# EAGLE design RPi-Display_v10 (EAGLE 7.5.0)
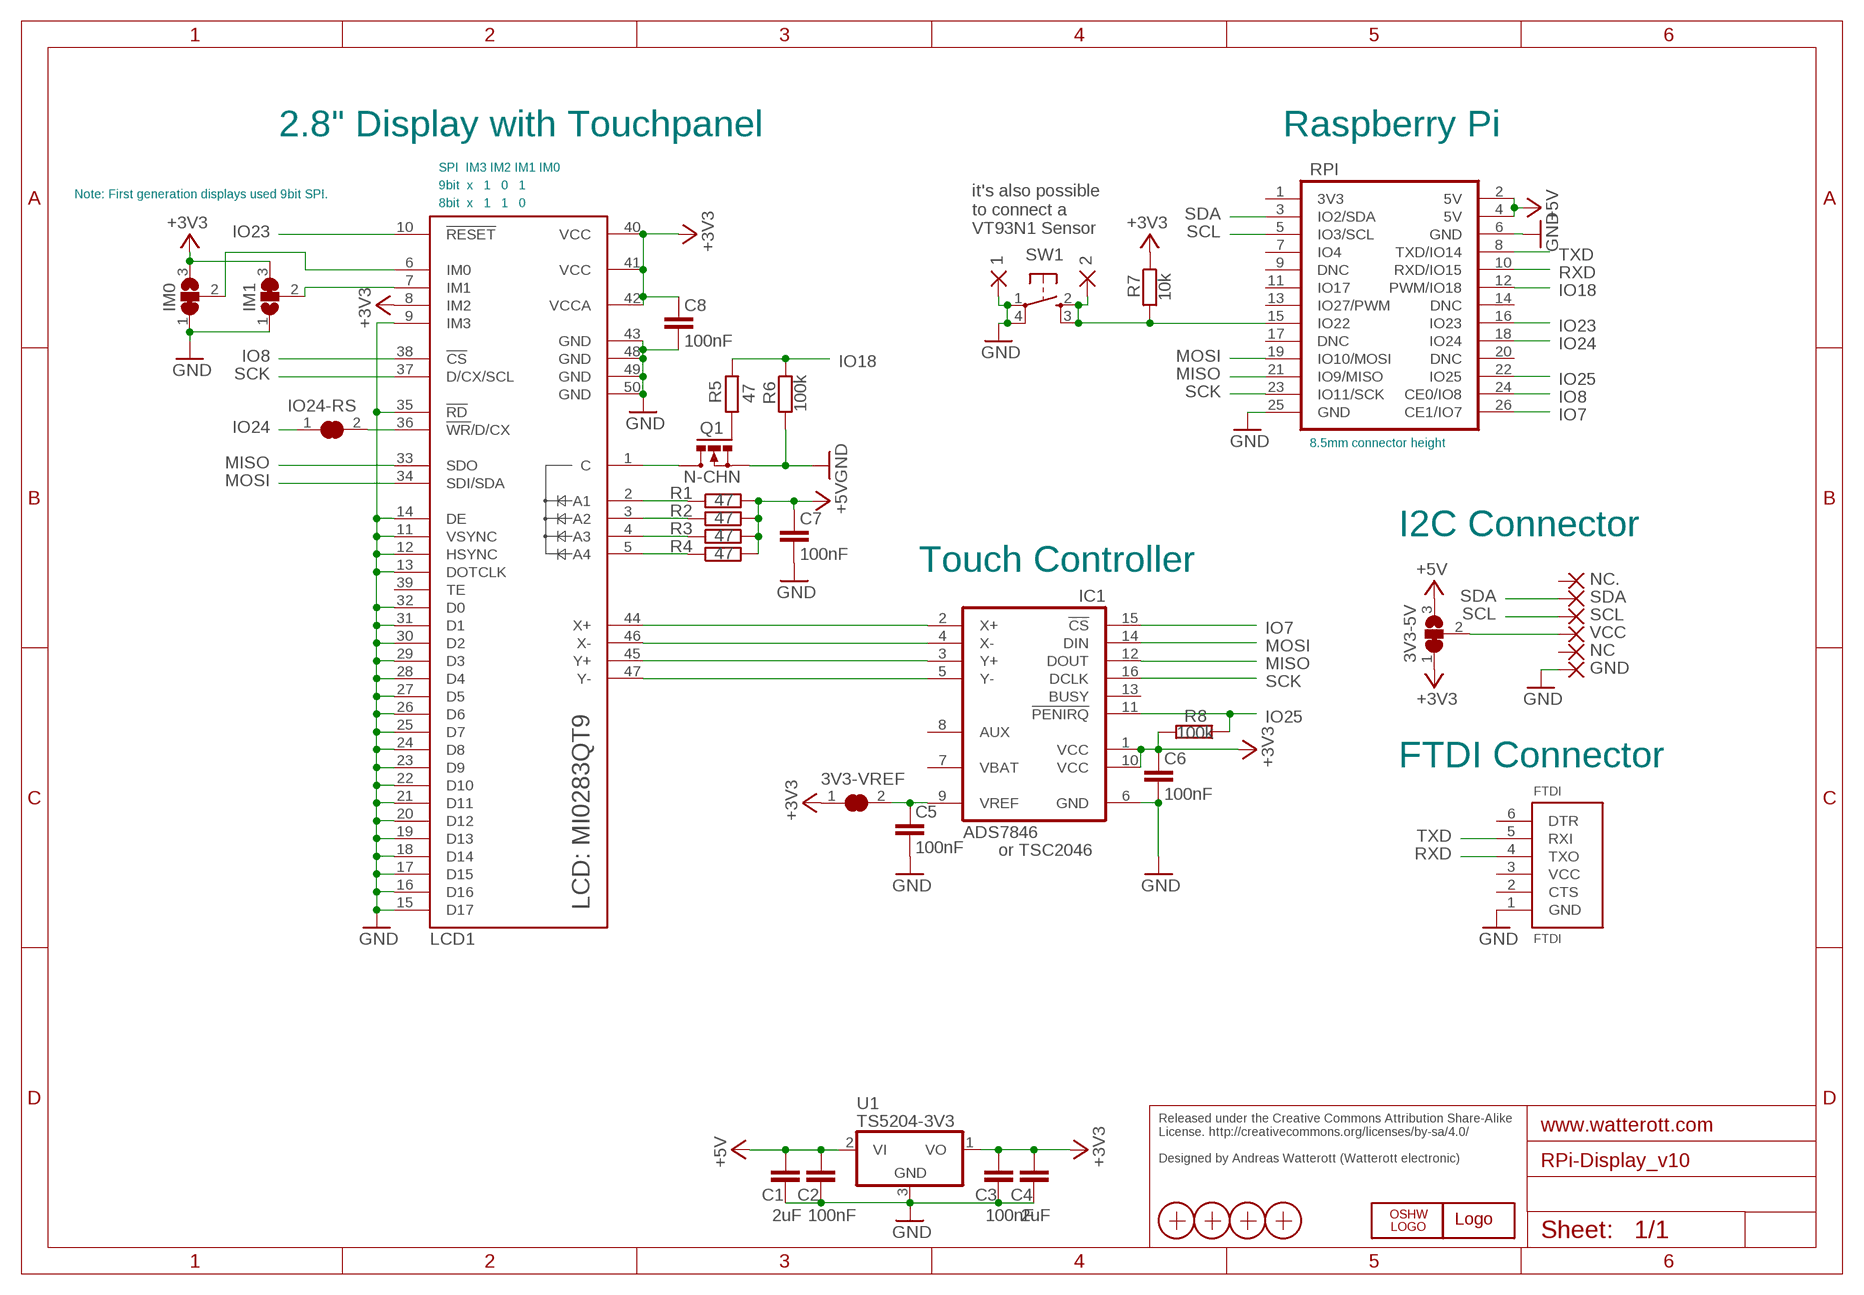
[diagram p0: schematic, sheet 1]

## Parts
1  WIREPADSMD1,27-254  [SMD1,27-2,54]
2  WIREPADSMD1,27-254  [SMD1,27-2,54]
3V3-5V  SJ2W  [SJ_2]
3V3-VREF  SJ  [SJ]
C1  2uF  C-EUC0603  [C0603]
C2  100nF  C-EUC0603  [C0603]
C3  100nF  C-EUC0603  [C0603]
C4  2uF  C-EUC0603  [C0603]
C5  100nF  C-EUC0603  [C0603]
C6  100nF  C-EUC0603  [C0603]
C7  100nF  C-EUC0603  [C0603]
C8  100nF  C-EUC0603  [C0603]
FTDI  FTDI  [FTDI]
GND  WIREPADSMD1,27-254  [SMD1,27-2,54]
IC1  ADS7846  [SSOP16]
IM0  SJ2W  [SJ_2]
IM1  SJ2W  [SJ_2]
IO24-RS  SJ  [SJ]
LCD1  MI0283QT9  [MI0283QT9]
LOGO1  OSHW_LOGO_6MILX0150-NT  [OSHW_6X150_NOTEXT]
NC  WIREPADSMD1,27-254  [SMD1,27-2,54]
NC.  WIREPADSMD1,27-254  [SMD1,27-2,54]
Q1  N-CHN  IRLML2502  [MICRO3]
R1  47  R-EU_R0603  [R0603]
R2  47  R-EU_R0603  [R0603]
R3  47  R-EU_R0603  [R0603]
R4  47  R-EU_R0603  [R0603]
R5  47  R-EU_R0603  [R0603]
R6  100k  R-EU_R0603  [R0603]
R7  10k  R-EU_R0603  [R0603]
R8  100k  R-EU_R0603  [R0603]
RPI  RPI  [RPI]
SCL  WIREPADSMD1,27-254  [SMD1,27-2,54]
SDA  WIREPADSMD1,27-254  [SMD1,27-2,54]
SW1  SW4S  [SW_SMD4]
U1  TS5204-3V3  TS5204  [SOT23]
U$1  WE-LOGO  WE-LOGOPLACE  [WE-LOGO]
VCC  WIREPADSMD1,27-254  [SMD1,27-2,54]
X1  PASSER  [PASSER]
X2  PASSER  [PASSER]
X3  PASSER  [PASSER]
X4  PASSER  [PASSER]

## Nets
+3V3: 3V3-5V.1 3V3-VREF.1 C3.1 C4.1 C6.1 C8.1 IC1.1(VCC) IC1.10(VCC) IM0.3 IM1.3 LCD1.8(IM2) LCD1.40(VCC) LCD1.41(VCC) LCD1.42(VCCA) R7.1 R8.2 U1.1(VO)
+5V: 3V3-5V.3 C1.1 C2.1 C7.1 R1.2 R2.2 R3.2 R4.2 RPI.2(5V) RPI.4(5V) U1.2(VI)
C1: LCD1.1(C) Q1.3(D)
GND: 1.1(P) C1.2 C2.2 C3.2 C4.2 C5.2 C6.2 C7.2 C8.2 FTDI.1(GND) GND.1(P) IC1.6(GND) IM0.1 IM1.1 LCD1.9(IM3) LCD1.11(VSYNC) LCD1.12(HSYNC) LCD1.13(DOTCLK) LCD1.14(DE) LCD1.15(D17) LCD1.16(D16) LCD1.17(D15) LCD1.18(D14) LCD1.19(D13) LCD1.20(D12) LCD1.21(D11) LCD1.22(D10) LCD1.23(D9) LCD1.24(D8) LCD1.25(D7) LCD1.26(D6) LCD1.27(D5) LCD1.28(D4) LCD1.29(D3) LCD1.30(D2) LCD1.31(D1) LCD1.32(D0) LCD1.35(!RD) LCD1.43(GND) LCD1.48(GND) LCD1.49(GND) LCD1.50(GND) Q1.2(S) R6.2 RPI.6(GND) RPI.25(GND) SW1.1(P) SW1.4(P1) U1.3(GND)
IM0: IM0.2 LCD1.6(IM0)
IM1: IM1.2 LCD1.7(IM1)
IO7: IC1.15(!CS) RPI.26(CE1/IO7)
IO8: LCD1.38(!CS) RPI.24(CE0/IO8)
IO18: R5.2 R6.1 RPI.12(PWM/IO18)
IO22: 2.1(P) R7.2 RPI.15(IO22) SW1.2(S) SW1.3(S1)
IO23: LCD1.10(!RESET) RPI.16(IO23)
IO24: IO24-RS.1 RPI.18(IO24)
IO25: IC1.11(!PENIRQ) R8.1 RPI.22(IO25)
LED_A1: LCD1.2(A1) R1.1
LED_A2: LCD1.3(A2) R2.1
LED_A3: LCD1.4(A3) R3.1
LED_A4: LCD1.5(A4) R4.1
LEDPWM: Q1.1(G) R5.1
MISO: IC1.12(DOUT) LCD1.33(SDO) RPI.21(IO9/MISO)
MOSI: IC1.14(DIN) LCD1.34(SDI/SDA) RPI.19(IO10/MOSI)
N$1: IO24-RS.2 LCD1.36(!WR!/D/CX)
N$5: 3V3-5V.2 VCC.1(P)
RXD: FTDI.4(TXO) RPI.10(RXD/IO15)
SCK: IC1.16(DCLK) LCD1.37(D/CX/SCL) RPI.23(IO11/SCK)
SCL: RPI.5(IO3/SCL) SCL.1(P)
SDA: RPI.3(IO2/SDA) SDA.1(P)
TXD: FTDI.5(RXI) RPI.8(TXD/IO14)
VREF: 3V3-VREF.2 C5.1 IC1.9(VREF)
X+: IC1.2(X+) LCD1.44(X+)
X-: IC1.4(X-) LCD1.46(X-)
Y+: IC1.3(Y+) LCD1.45(Y+)
Y-: IC1.5(Y-) LCD1.47(Y-)
Unconnected: FTDI.2(CTS) FTDI.3(VCC) FTDI.6(DTR) IC1.7(VBAT) IC1.8(AUX) IC1.13(BUSY) LCD1.39(TE) NC.1(P) NC..1(P) RPI.1(3V3) RPI.7(IO4) RPI.9(DNC) RPI.11(IO17) RPI.13(IO27/PWM) RPI.14(DNC) RPI.17(DNC) RPI.20(DNC)

## Notes on the sheet
- 2.8" Display with Touchpanel | Raspberry Pi
- SPI  IM3 IM2 IM1 IM0
- 9bit  x   1   0   1
- Note: First generation displays used 9bit SPI.
- 8bit  x   1   1   0
- it's also possible
  to connect a
  VT93N1 Sensor
- 8.5mm connector height
- I2C Connector
- Touch Controller
- FTDI Connector
- or TSC2046
- Released under the Creative Commons Attribution Share-Alike 
  License. http://creativecommons.org/licenses/by-sa/4.0/
  
  Designed by Andreas Watterott (Watterott electronic)

## Library data of the parts
1 2 GND NC NC. SCL SDA VCC = wirepad:WIREPAD: Wire PAD connect wire on PCB
3V3-5V IM0 IM1 = jumper:SJ2W: SMD solder JUMPER
3V3-VREF IO24-RS = jumper:SJ: SMD solder JUMPER
C1-C8 = rcl:C-EU: CAPACITOR, European symbol
FTDI = Arduino:FTDI: 6pol FTDI Connector
IC1 = Display:ADS7846: ADS7846 Touch Screen Controller
LCD1 = Display:MI0283QT9: Multi-Inno MIO283QT9 LCD (240x320) with Ilitek ILI9341 controller
LOGO1 = OSHW:OSHW_LOGO_6MIL
Q1 = IRF-sot23:IRLML2502: N-Channel Power MOSFET
R1-R8 = rcl:R-EU_: RESISTOR, European symbol
RPI = RaspberryPi:RPI; OC_FARNELL: unknown; OC_NEWARK: unknown
SW1 = Switch-SMD:SW4
U1 = Voltage-Reg:TS5204
U$1 = welectronic:WE-LOGO
X1-X4 = SMD:PASSER

## Board
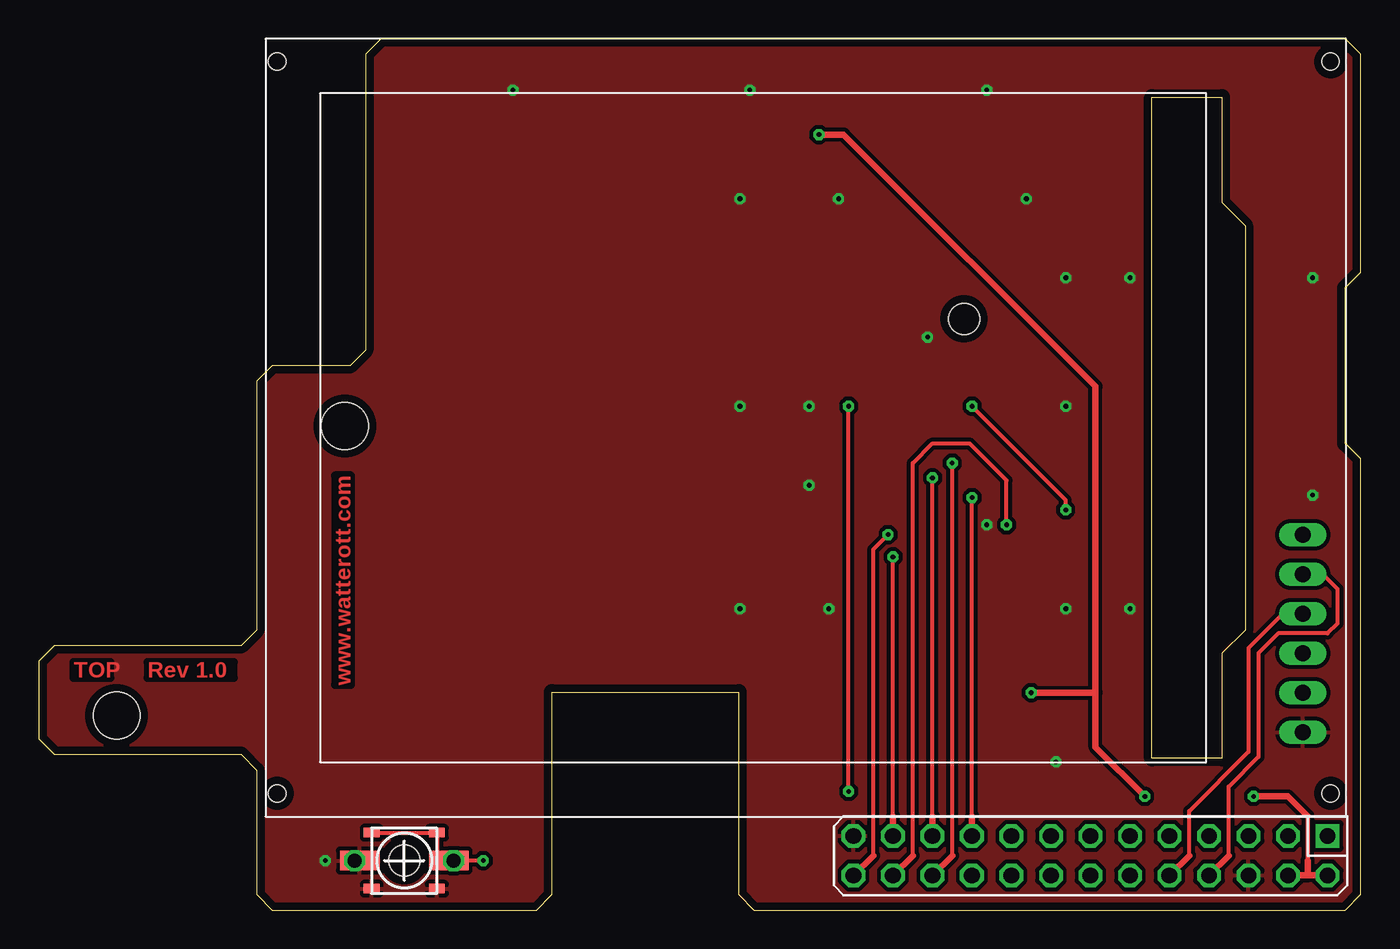
[diagram p1: board, top side]
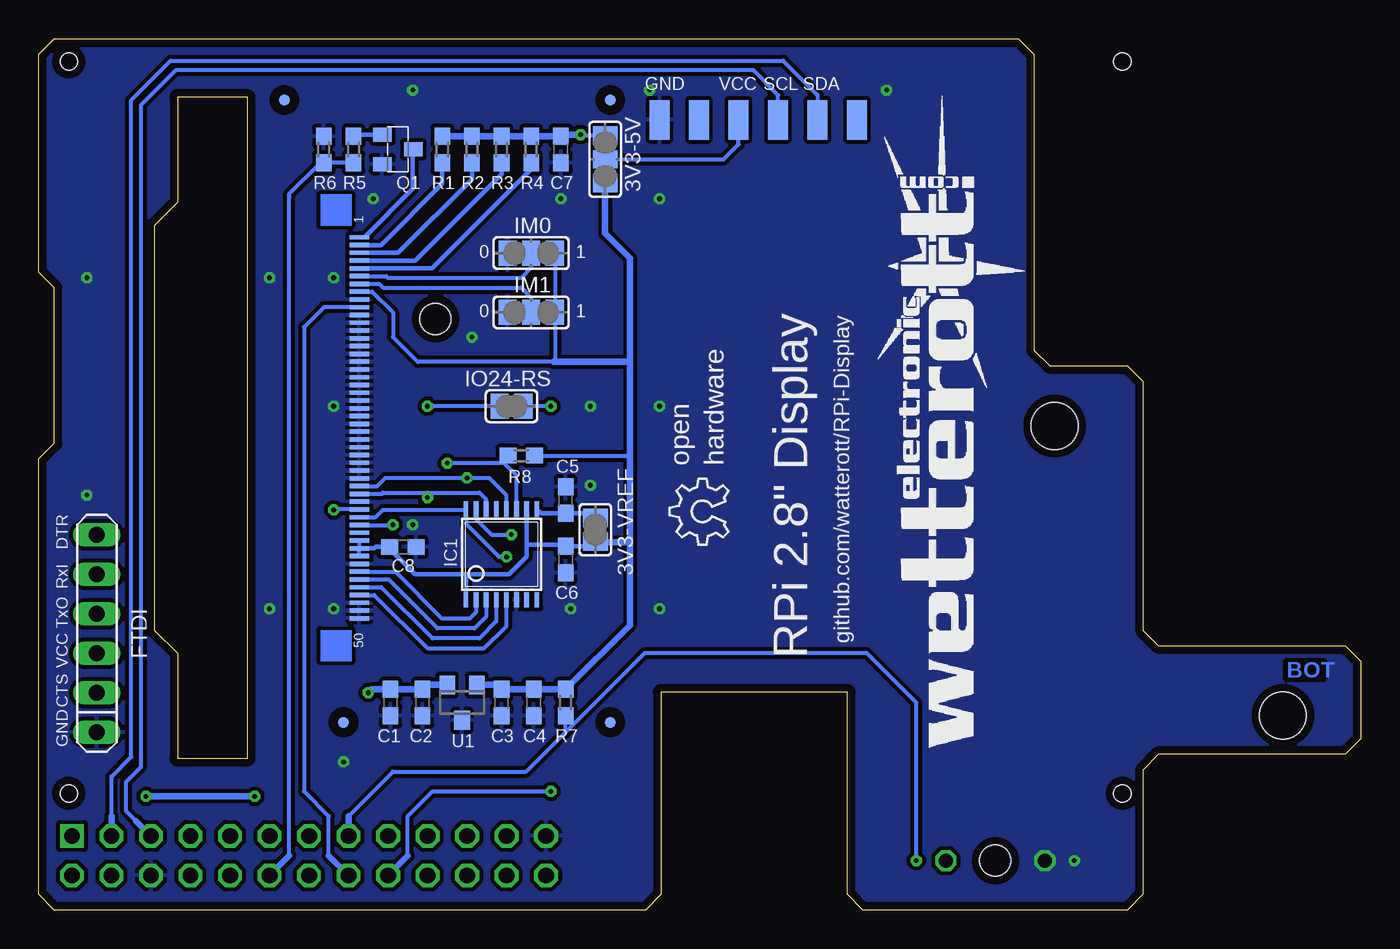
[diagram p2: board, bottom side, seen from below]

Size 85 x 56 mm. Coordinates in mm from the lower left corner, seen from the top.
Outline: 14,1 15,0 32,0 33,1 33,14 45,14 45,1 46,0 84,0 85,1 85,29 84,30 84,40 85,41 85,55 84,56 22,56 21,55 21,36 20,35 15,35 14,34 14,18 13,17 1,17 0,16 0,11 1,10 13,10 14,9 14,1
Copper layers (1*16): Top 0.035mm / dielectric 1.5mm / Bottom 0.035mm
Design rules "default *": minimum track width 8mil, minimum drill 0.3mm, track to track 8mil, track to pad 8mil, pad to pad 8mil, via to via 8mil, smd to smd 8mil, copper to edge 20mil, drill to drill 8mil, minimum pad ring 10mil, minimum via ring 8mil, stop-mask expansion 0.3mm, vias tented up to drill 0.5mm, thermal gap 10mil
Holes 3 mm at 5,12.5 19.68,31.11
Holes 2 mm at 59.5,38 23.5,3.17

### Footprints (pad centres in the part's own frame; a part is rotated, then mirrored left to right if it is on the bottom)
SMD1,27-2,54 = smd 1.27 x 2.54: 1 0,0
SJ_2 = smd 1.168 x 1.6: 1 -1.524,0; 2 0,0; 3 1.524,0
SJ = smd 1.168 x 1.6: 1 -0.762,0; 2 0.762,0
C0603 = smd 1.1 x 1: 1 -0.85,0; 2 0.85,0
FTDI = drill 1.016 long: 1 -6.35,0; 2 -3.81,0; 3 -1.27,0; 4 1.27,0; 5 3.81,0; 6 6.35,0
SSOP16 = smd 0.305 x 0.991: 1 -2.925,-2.918; 2 -2.275,-2.918; 3 -1.625,-2.918; 4 -0.975,-2.918; 5 -0.325,-2.918; 6 0.325,-2.918; 7 0.975,-2.918; 8 1.625,-2.918; 9 1.625,2.918; 10 0.975,2.918; 11 0.325,2.918; 12 -0.325,2.918; 13 -0.975,2.918; 14 -1.625,2.918; 15 -2.275,2.918; 16 -2.925,2.918
MI0283QT9 = smd 0.279 x 1.27 bottom: 1 12.25,19.683; 2 11.75,19.683; 3 11.25,19.683; 4 10.75,19.683; 5 10.25,19.683; 6 9.75,19.683; 7 9.25,19.683; 8 8.75,19.683; 9 8.25,19.683; 10 7.75,19.683; 11 7.25,19.683; 12 6.75,19.683; 13 6.25,19.683; 14 5.75,19.683; 15 5.25,19.683; 16 4.75,19.683; 17 4.25,19.683; 18 3.75,19.683; 19 3.25,19.683; 20 2.75,19.683; 21 2.25,19.683; 22 1.75,19.683; 23 1.25,19.683; 24 0.75,19.683; 25 0.25,19.683; 26 -0.25,19.683; 27 -0.75,19.683; 28 -1.25,19.683; 29 -1.75,19.683; 30 -2.25,19.683; 31 -2.75,19.683; 32 -3.25,19.683; 33 -3.75,19.683; 34 -4.25,19.683; 35 -4.75,19.683; 36 -5.25,19.683; 37 -5.75,19.683; 38 -6.25,19.683; 39 -6.75,19.683; 40 -7.25,19.683; 41 -7.75,19.683; 42 -8.25,19.683; 43 -8.75,19.683; 44 -9.25,19.683; 45 -9.75,19.683; 46 -10.25,19.683; 47 -10.75,19.683; 48 -11.25,19.683; 49 -11.75,19.683; 50 -12.25,19.683 | hole 1.1: 23.54,1; -23.5,1; 23.54,68.75; -23.5,68.75
MICRO3 = smd 0.9 x 1.2: 1 -0.95,-1; 2 0.95,-1; 3 0,1
R0603 = smd 1.1 x 1: 1 -0.85,0; 2 0.85,0
RPI = drill 1.016 square: 1 -15.24,-1.27 | drill 1.016 octagon: 2 -15.24,1.27; 3 -12.7,-1.27; 4 -12.7,1.27; 5 -10.16,-1.27; 6 -10.16,1.27; 7 -7.62,-1.27; 8 -7.62,1.27; 9 -5.08,-1.27; 10 -5.08,1.27; 11 -2.54,-1.27; 12 -2.54,1.27; 13 0,-1.27; 14 0,1.27; 15 2.54,-1.27; 16 2.54,1.27; 17 5.08,-1.27; 18 5.08,1.27; 19 7.62,-1.27; 20 7.62,1.27; 21 10.16,-1.27; 22 10.16,1.27; 23 12.7,-1.27; 24 12.7,1.27; 25 15.24,-1.27; 26 15.24,1.27
SW_SMD4 = smd 0.61 x 1.016: 1 -1.8,-2.1; 2 1.8,-2.1; 3 1.8,2.1; 4 -1.8,2.1
SOT23 = smd 1 x 1.2: 1 -0.95,-1.132; 2 0.95,-1.132; 3 0,1.132
PASSER = smd 0.7 x 0.7: X 0,0

### Placement (x,y rotation side)
1  20.64,3.17 90 top
2  26.35,3.17 90 top
3V3-5V  48.58,48.26 90 bottom
3V3-VREF  49.21,24.45 90 bottom
C1  62.39,13.34 270 bottom
C2  60.33,13.34 270 bottom
C3  55.24,13.34 270 bottom
C4  53.18,13.34 270 bottom
C5  51.12,26.35 90 bottom
C6  51.12,22.54 270 bottom
C7  51.44,48.9 270 bottom
C8  61.59,23.34 0 bottom
FTDI  81.28,17.78 90 bottom
GND  45.09,50.8 0 bottom
IC1  54.61,22.86 0 bottom
IM0  53.34,42.23 0 bottom
IM1  53.34,38.42 0 bottom
IO24-RS  54.61,32.38 180 bottom
LCD1  84.07,31 90 top
LOGO1  40.64,23.5 90 bottom
NC  42.55,50.8 0 bottom
NC.  32.38,50.8 0 bottom
Q1  61.91,48.9 270 bottom
R1  59.05,48.9 90 bottom
R2  57.15,48.9 90 bottom
R3  55.24,48.9 90 bottom
R4  53.34,48.9 90 bottom
R5  64.77,48.9 270 bottom
R6  66.67,48.9 90 bottom
R7  51.12,13.34 270 bottom
R8  53.98,29.21 0 bottom
RPI  67.63,3.49 180 top
SCL  37.47,50.8 0 bottom
SDA  34.92,50.8 0 bottom
SW1  23.5,3.17 90 top
U1  57.78,13.34 180 bottom
U$1  21.27,10.16 90 bottom
VCC  40.01,50.8 0 bottom
X1  48.26,12.06 0 bottom
X2  48.26,52.07 0 bottom
X3  69.22,52.07 0 bottom
X4  65.41,12.06 0 bottom

### Tracks (layer width: path | path; a pad name or v marks a point on that pad's centre or on a via)
+3V3
  Bottom 0.254: IM0.3 IM1.3 51.82,35.34 51.91,35.24 60.64,35.24 62.23,36.83 62.23,38.42 63.56,39.75 LCD1.8 | LCD1.40 LCD1.41 LCD1.42 | 63.43,23.25 63.34,23.34 | C6.1 51.22,23.5 | R7.1 51.12,14.29 | 62.15,22.94 62.23,23.02 | 57.53,21.52 57.47,21.59 | 49.21,23.65 3V3-VREF.1 | R8.2 46.99,29.21
  Bottom 0.305: 63.34,23.34 C8.1 62.45,23.23 62.15,22.94 60.8,21.59 57.47,21.59 54.77,21.59 53.63,22.72 53.63,23.5 | LCD1.41 63.43,23.25 | IC1.10 53.63,23.5 | 51.22,23.5 53.63,23.5 | C6.1 49.51,23.39 3V3-VREF.1 | IC1.1 57.53,21.52 | 62.23,23.28 62.23,23.02
  Bottom 0.406: U1.1 55.53,14.47 C3.1 C4.1 R7.1 46.99,18.31 46.99,23.65 | 51.91,35.24 46.99,35.24 | 46.99,35.24 46.99,29.21 46.99,23.65 | 49.21,23.65 46.99,23.65 | 3V3-5V.1 48.58,43.5 46.99,41.91 46.99,35.24
+5V  (via drill 0.3)
  Top 0.305: 81.6,3.17 81.6,6.03
  Top 0.406: RPI.2 81.6,2.22 | RPI.4 81.6,2.22 | 81.6,2.22 81.6,3.17 | v71.12,7.3 67.94,10.48 67.94,13.97 | v63.82,13.97 67.94,13.97 | 67.94,13.97 67.94,33.66 51.75,49.85 v50.16,49.85 | v78.11,7.3 80.33,7.3 81.6,6.03
  Bottom 0.254: 60.04,14.47 C2.1 | C7.1 51.44,49.85 | 3V3-5V.3 50.1,49.78 v50.16,49.85
  Bottom 0.406: C7.1 R4.2 R3.2 R2.2 R1.2 | C2.1 C1.1 63.6,14.19 v63.82,13.97 | U1.2 60.04,14.47 | v50.16,49.85 51.44,49.85 | v71.12,7.3 v78.11,7.3
C1
  Bottom 0.279: LCD1.1 64.06,43.25
  Bottom 0.305: 64.06,43.25 60.96,46.35 60.96,48.85 Q1.3
GND  (via drill 0.3, 0.9)
  other vias: 57.15,36.83 66.04,19.37 70.17,19.37 18.41,3.17 63.5,45.72 66.04,32.38 70.17,40.64 66.04,40.64 51.44,45.72 50.8,19.37 60.96,24.77 49.53,27.3 45.09,19.37 45.09,32.38 45.09,45.72 65.41,9.53 60.96,52.7 81.92,40.64 81.92,26.67 30.48,52.7 20.32,3.17 45.72,52.7 49.53,32.38
  pour Top (isolate 0.254): 0,0 85,0 85,56 0,56
  pour Bottom (isolate 0.254): 0,0 85,0 85,56 0,56
IM0
  Bottom 0.254: LCD1.6 62.66,40.75 62.55,40.64 53.98,40.64 53.34,41.27 IM0.2
IM1
  Bottom 0.254: LCD1.7 63.11,40.25 62.87,40.01 53.98,40.01 53.34,39.37 IM1.2
IO7  (via drill 0.3)
  Top 0.254: 53.66,3.49 53.66,23.18 v54.61,24.13
  Top 0.406: RPI.26 53.66,3.49
  Bottom 0.254: IC1.15 56.88,25.14 55.88,24.13 v54.61,24.13
IO8  (via drill 0.3)
  Top 0.254: 56.2,3.49 56.2,28.73 57.47,30 59.85,30 62.23,27.62 v62.23,24.77
  Top 0.406: RPI.24 56.2,3.49
  Bottom 0.254: LCD1.38 62.24,24.75 v62.23,24.77
IO18
  Bottom 0.254: 68.9,3.49 68.9,45.82 68.9,46.04 66.99,47.94 66.78,47.94 R6.1 R5.2
  Bottom 0.406: RPI.12 68.9,3.49
IO22  (via drill 0.3, 0.9)
  Top 0.254: v28.57,3.17 v26.67,3.17 2.1 25.72,3.17 25.59,3.3 SW1.2 SW1.3
  Bottom 0.254: 65.09,6.03 62.23,8.89 53.66,8.89 51.12,11.43 | 51.12,11.43 R7.2 | v28.57,3.17 28.57,13.34 31.75,16.51 46.04,16.51 51.12,11.43
  Bottom 0.406: RPI.15 65.09,6.03
IO23
  Bottom 0.254: LCD1.10 66.66,38.75 67.94,37.47 67.94,7.62 66.36,6.03 66.36,3.49
  Bottom 0.406: RPI.16 66.36,3.49
IO24  (via drill 0.3)
  Top 0.254: v52.07,7.62 v52.07,32.38
  Bottom 0.254: 61.28,3.49 61.28,6.03 59.69,7.62 v52.07,7.62 | v52.07,32.38 IO24-RS.1
  Bottom 0.406: RPI.18 61.28,3.49
IO25  (via drill 0.3)
  Top 0.254: 58.74,3.49 v58.74,28.73
  Top 0.406: RPI.22 58.74,3.49
  Bottom 0.254: 55.09,28.73 v58.74,28.73 | IC1.11 54.28,27.93 55.09,28.73 | 55.09,28.73 55.09,28.95 R8.1
LED_A1
  Bottom 0.279: LCD1.2 62.98,42.75
  Bottom 0.305: 62.98,42.75 59.05,46.67 R1.1
LED_A2
  Bottom 0.279: LCD1.3 61.89,42.25
  Bottom 0.305: 61.89,42.25 57.15,46.99 R2.1
LED_A3
  Bottom 0.279: LCD1.4 60.8,41.75
  Bottom 0.305: 60.8,41.75 55.24,47.31 R3.1
LED_A4
  Bottom 0.279: LCD1.5 59.72,41.25
  Bottom 0.305: 59.72,41.25 53.34,47.62 R4.1
LEDPWM
  Bottom 0.305: Q1.1 64.67,49.84 R5.1
MISO  (via drill 0.3)
  Top 0.254: 57.47,6.03 v57.47,27.78
  Top 0.406: RPI.21 57.47,6.03
  Bottom 0.254: LCD1.33 63.24,27.25 62.71,27.78 v57.47,27.78 56.04,27.78 54.94,26.68 IC1.12
MOSI  (via drill 0.3)
  Top 0.254: 60.01,6.03 v60.01,26.51
  Top 0.406: RPI.19 60.01,6.03
  Bottom 0.254: LCD1.34 62.94,26.75 62.87,26.83 60.01,26.83 | 60.01,26.83 56.67,26.83 56.23,26.39 IC1.14 | v60.01,26.51 60.01,26.83
N$1  (via drill 0.3)
  Top 0.254: v60.01,32.38 66.04,26.35 v66.04,25.72
  Bottom 0.254: IO24-RS.2 v60.01,32.38 | LCD1.36 66.01,25.75 v66.04,25.72
N$2
  Bottom 0.254: 49.21,25.08 49.21,23.81
N$3
  Bottom 0.254: 53.66,42.23 54.61,42.23
N$4
  Bottom 0.254: 52.07,38.42 53.02,38.42
N$5
  Bottom 0.254: 3V3-5V.2 40.96,48.26 40.01,49.21 VCC.1
N$6
  Bottom 0.254: 48.58,46.99 48.58,47.94
N$7
  Bottom 0.254: 53.98,32.38 55.24,32.38
RXD
  Top 0.254: 73.98,3.49 73.98,6.35 77.79,10.16 77.79,16.83 80.01,19.05 FTDI.4
  Top 0.406: RPI.10 73.98,3.49
SCK  (via drill 0.3)
  Top 0.254: 54.93,6.03 v54.93,22.7
  Top 0.406: RPI.23 54.93,6.03
  Bottom 0.254: LCD1.37 63.33,25.25 62.87,25.72 57.59,25.72 IC1.16 57.53,24.83 55.4,22.7 v54.93,22.7
SCL
  Bottom 0.254: SCL.1 37.47,52.39 39.05,53.98 76.2,53.98 78.42,51.75 78.42,9.21 79.38,8.26 79.38,6.35 78.74,5.71
  Bottom 0.406: RPI.5 78.74,5.71
SDA
  Bottom 0.254: SDA.1 34.92,52.39 37.15,54.61 76.52,54.61 79.06,52.07 79.06,9.84 80.33,8.57 80.33,6.03
  Bottom 0.406: RPI.3 80.33,6.03
TXD
  Top 0.254: 76.52,3.49 76.52,7.94 78.42,9.84 78.42,16.51 79.69,17.78 82.87,17.78 83.5,18.41 83.5,20.64 82.55,21.59 FTDI.5
  Top 0.406: RPI.8 76.52,3.49
VREF
  Bottom 0.305: 3V3-VREF.2 49.51,25.5 C5.1 52.71,25.5 IC1.9
X+
  Bottom 0.254: IC1.2 56.88,19.16 57.31,18.73 59.05,18.73 62.07,21.75 LCD1.44
X-
  Bottom 0.254: IC1.4 55.59,18.55 56.67,17.46 59.69,17.46 62.98,20.75 LCD1.46
Y+
  Bottom 0.254: LCD1.45 62.52,21.25 59.37,18.1 56.99,18.1 56.23,18.85 IC1.3
Y-
  Bottom 0.254: LCD1.47 63.43,20.25 60.01,16.83 56.36,16.83 54.93,18.26 54.93,19.93 IC1.5

### Text on the board
Top: www.watterott.com | TOP | Rev 1.0
Bottom: BOT
bPlace: hardware | open | github.com/watterott/RPi-Display | RPi 2.8" Display
bNames: 1 | 0 | 1 | 0
Reference: 2.0mm PCB, Silkscreen: 22 bPlace + 26 bNames